# EAGLE schematic zx81c (EAGLE 7.6.0)
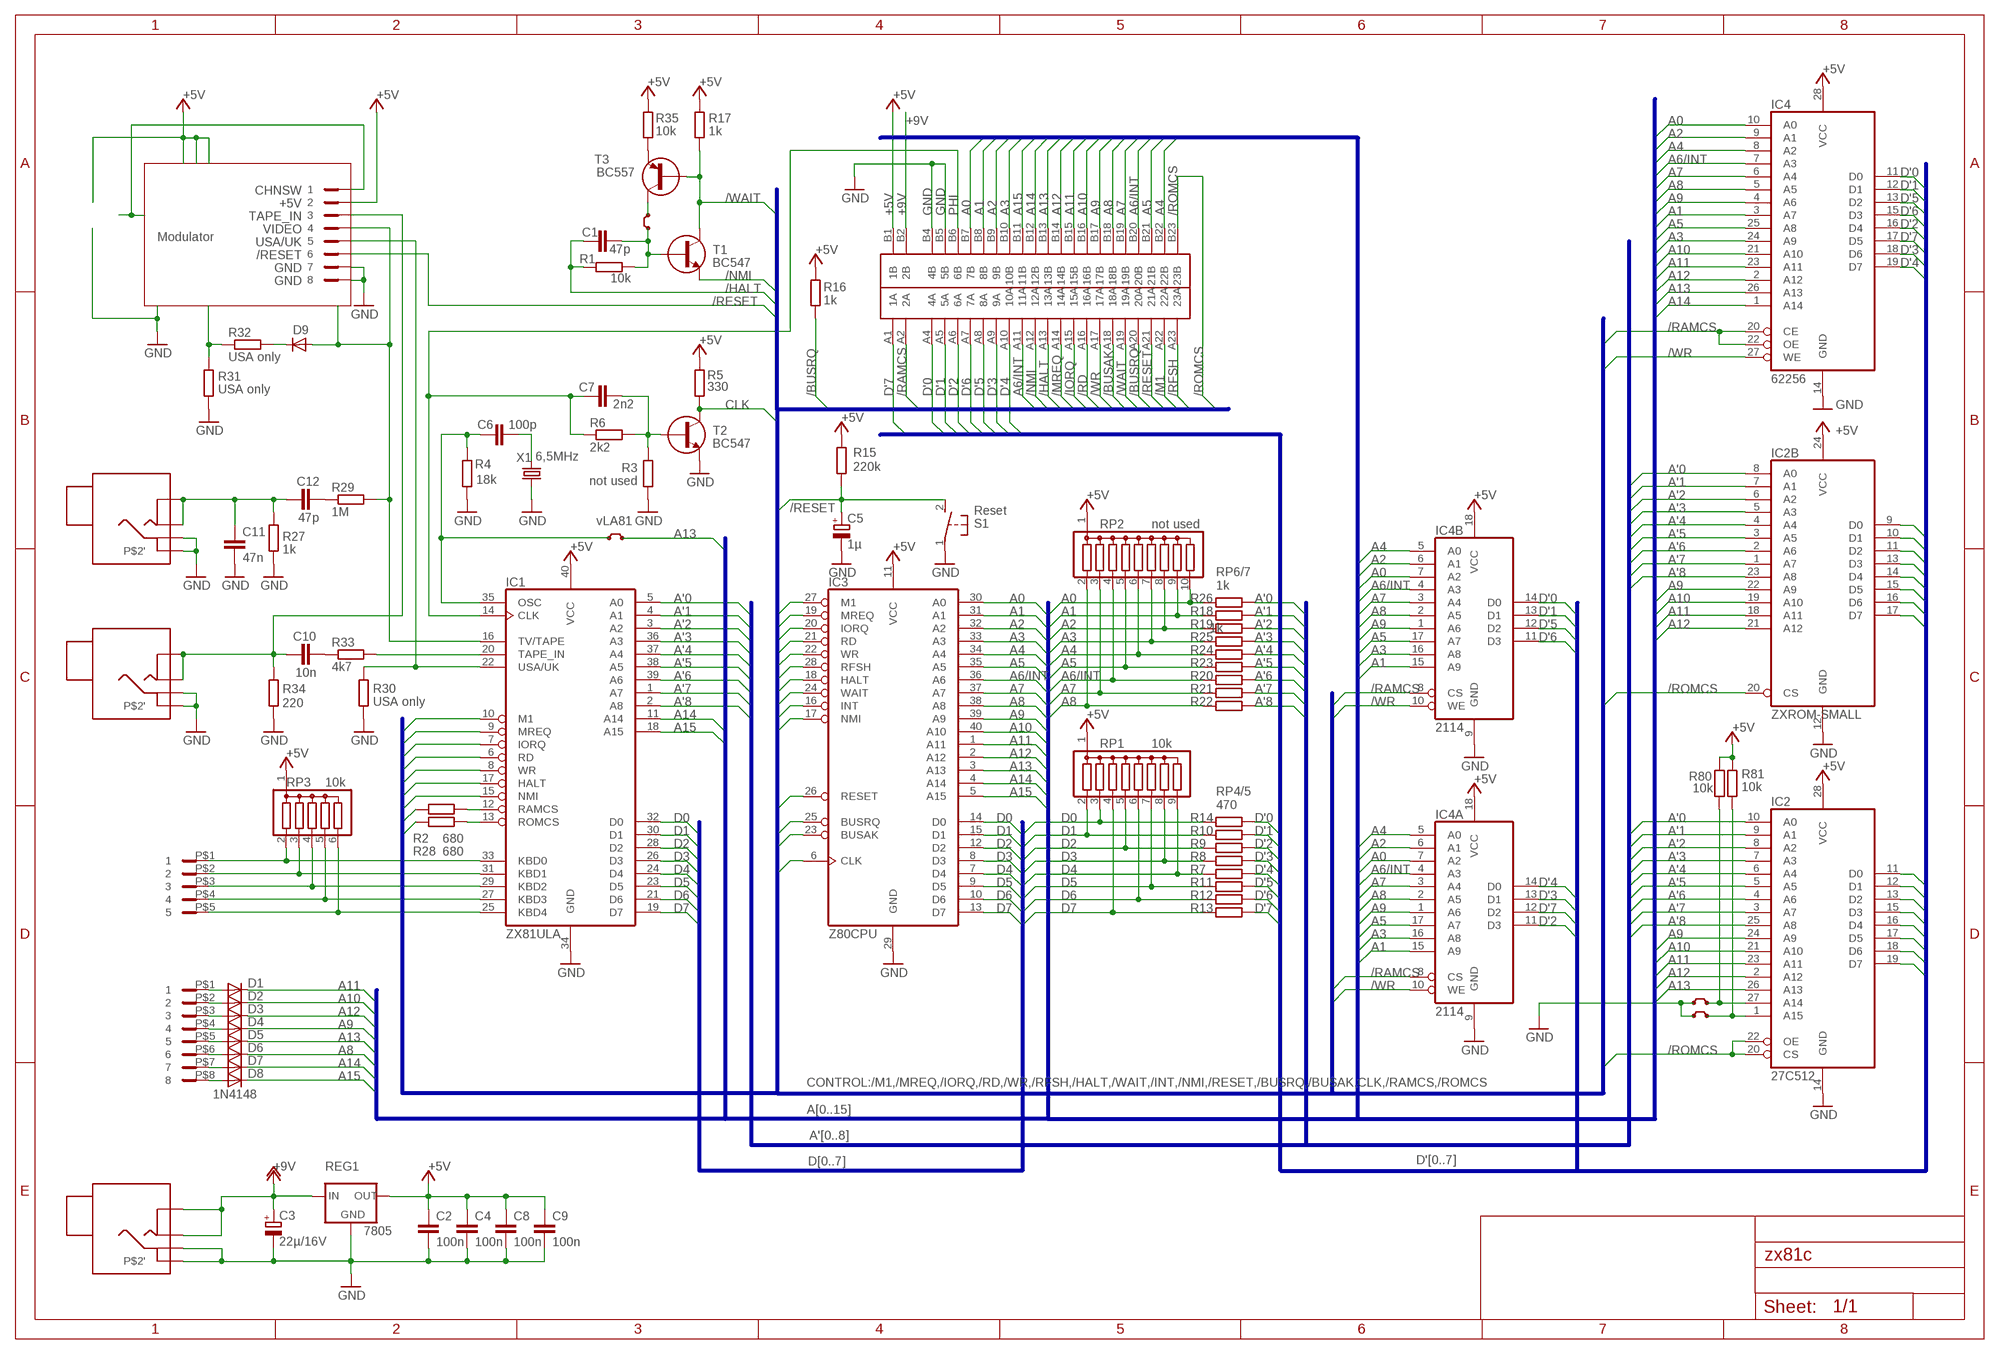
[diagram p0: schematic, sheet 1]

## Parts
C1  47p  C  [C025-025X050]
C2  100n  C  [C025-025X050]
C3  22µ/16V  CPOLE5-5  [E5-5]
C4  100n  C  [C025-025X050]
C5  1µ  CPOLE3,8-5  [E3,8-5]
C6  100p  C  [C025-025X050]
C7  2n2  C  [C025-025X050]
C8  100n  C  [C025-025X050]
C9  100n  C  [C025-025X050]
C10  10n  C  [C025-025X050]
C11  47n  C  [C025-025X050]
C12  47p  C  [C025-025X050]
D1  1N4148  DIODEDTR  [D-TR-10]
D2  1N4148  DIODEDTR  [D-TR-10]
D3  1N4148  DIODEDTR  [D-TR-10]
D4  1N4148  DIODEDTR  [D-TR-10]
D5  1N4148  DIODEDTR  [D-TR-10]
D6  1N4148  DIODEDTR  [D-TR-10]
D7  1N4148  DIODEDTR  [D-TR-10]
D8  1N4148  DIODEDTR  [D-TR-10]
D9  DIODED15  [D15]
IC1  ZX81ULA  [DIL40]
IC2  27C512  [DIL28]
IC2B  ZXROM-SMALL  [DIL24]
IC3  Z80CPU  [DIL40]
IC4  62256  [DIL28]
IC4A  2114  [DIL18]
IC4B  2114  [DIL18]
JP1  JUMPER  [JUMPER]
JP2  JUMPER  [JUMPER]
JP3  JUMPER  [JUMPER]
JP4  JUMPER  [JUMPER]
K1  ZX81CONN  [ZX81CON]
K2  MIC  ZXKLINKE4POL  [ZXKLINKE4POL]
K3  EAR  ZXKLINKE4POL  [ZXKLINKE4POL]
K4  DCIN  ZXKLINKE4POL  [ZXKLINKE4POL]
K5  PINHEAD-2X4  [PINHEAD2X4]
KB1  ZXKBD5CON  [ZXKDB5]
KB2  ZXKBD8CON  [ZXKBD8]
R1  10k  RR207/12  [R207/12]
R2  680  RR207/12  [R207/12]
R3  not used  RR207/12  [R207/12]
R4  18k  RR207/12  [R207/12]
R5  330  RR207/12  [R207/12]
R6  2k2  RR207/12  [R207/12]
R15  220k  RR207/12  [R207/12]
R16  1k  RR207/12  [R207/12]
R17  1k  RR207/12  [R207/12]
R27  1k  RR207/12  [R207/12]
R28  680  RR207/12  [R207/12]
R29  1M  RR207/12  [R207/12]
R30  USA only  RR207/12  [R207/12]
R31  USA only  RR207/12  [R207/12]
R32  USA only  RR207/12  [R207/12]
R33  4k7  RR207/12  [R207/12]
R34  220  RR207/12  [R207/12]
R35  10k  RR207/12  [R207/12]
R80  10k  RR207/12  [R207/12]
R81  10k  RR207/12  [R207/12]
REG1  7805  78XX  [78XXL]
RP1  10k  RSIL8  [SIL9]
RP2  not used  RSIL9  [SIL10]
RP3  10k  RSIL5  [SIL6]
RP4  470  RSILP4  [SIL8P]
RP5  470  RSILP4  [SIL8P]
RP6  1k  RSILP4  [SIL8P]
RP7  1k  RSILP5  [SIL10P]
S1  Reset  31-XX  [B3F-31XX]
T1  BC547  T-NPN-BC547  [TO92]
T2  BC547  T-NPN-BC547  [TO92]
T3  BC557  T-PNP-BC557  [TO92]
X1  6,5MHz  CRYSTAL  [HC49]

## Nets
+5V: C2.1 C4.1 C8.1 C9.1 IC1.40(VCC) IC2.28(VCC) IC2B.24(VCC) IC3.11(VCC) IC4.28(VCC) IC4A.18(VCC) IC4B.18(VCC) K1.B1(1B) K5.2 R5.2 R15.2 R16.1 R17.2 R35.2 R80.2 R81.2 REG1.OUT RP1.1 RP2.1 RP3.1
+9V: C3.+ K1.B2(2B) K4.1 K4.1'(P$1') REG1.IN
/BUSAK: IC3.23(BUSAK) K1.A18(18A)
/BUSRQ: IC3.25(BUSRQ) K1.A20(20A) R16.2
/HALT: C1.1 IC1.17(HALT) IC3.18(HALT) K1.A13(13A) R1.1
/IORQ: IC1.7(IORQ) IC3.20(IORQ) K1.A15(15A)
/M1: IC1.10(M1) IC3.27(M1) K1.A22(22A)
/MREQ: IC1.9(MREQ) IC3.19(MREQ) K1.A14(14A)
/NMI: IC1.15(NMI) IC3.17(NMI) K1.A12(12A) T1.E
/RAMCS: IC4.20(CE) IC4.22(OE) IC4A.8(CS) IC4B.8(CS) K1.A2(2A) R2.2
/RD: IC1.6(RD) IC3.21(RD) K1.A16(16A)
/RESET: C5.+ IC3.26(RESET) K1.A21(21A) K5.6 R15.1 S1.2(S)
/RFSH: IC3.28(RFSH) K1.A23(23A)
/ROMCS: IC2.20(CS) IC2.22(OE) IC2B.20(CS) K1.B23(23B) R28.2
/WAIT: IC3.24(WAIT) K1.A19(19A) R17.1 T1.C T3.B
/WR: IC1.8(WR) IC3.22(WR) IC4.27(WE) IC4A.10(WE) IC4B.10(WE) K1.A17(17A)
A0: IC3.30(A0) IC4.10(A0) IC4A.7(A2) IC4B.7(A2) K1.B7(7B) RP2.10 RP6.8
A1: IC3.31(A1) IC4.3(A7) IC4A.15(A9) IC4B.15(A9) K1.B8(8B) RP2.9 RP7.1
A2: IC3.32(A2) IC4.9(A1) IC4A.6(A1) IC4B.6(A1) K1.B9(9B) RP2.8 RP7.4
A3: IC3.33(A3) IC4.24(A9) IC4A.16(A8) IC4B.16(A8) K1.B10(10B) RP2.7 RP6.6
A4: IC3.34(A4) IC4.8(A2) IC4A.5(A0) IC4B.5(A0) K1.B22(22B) RP2.6 RP6.4
A5: IC3.35(A5) IC4.25(A8) IC4A.17(A7) IC4B.17(A7) K1.B21(21B) RP2.5 RP6.2
A6/INT: IC3.16(INT) IC3.36(A6) IC4.7(A3) IC4A.4(A3) IC4B.4(A3) K1.A11(11A) K1.B20(20B) RP2.4 RP7.6
A7: IC3.37(A7) IC4.6(A4) IC4A.3(A4) IC4B.3(A4) K1.B19(19B) RP2.3 RP7.8
A8: D6.C IC3.38(A8) IC4.5(A5) IC4A.2(A5) IC4B.2(A5) K1.B18(18B) RP2.2 RP7.10
A9: D4.C IC2.24(A9) IC2B.22(A9) IC3.39(A9) IC4.4(A6) IC4A.1(A6) IC4B.1(A6) K1.B17(17B)
A10: D2.C IC2.21(A10) IC2B.19(A10) IC3.40(A10) IC4.21(A10) K1.B16(16B)
A11: D1.C IC2.23(A11) IC2B.18(A11) IC3.1(A11) IC4.23(A11) K1.B15(15B)
A12: D3.C IC2.2(A12) IC2B.21(A12) IC3.2(A12) IC4.2(A12) K1.B14(14B)
A13: D5.C IC2.26(A13) IC3.3(A13) IC4.26(A13) JP3.2 K1.B13(13B)
A14: D7.C IC1.11(A14) IC3.4(A14) IC4.1(A14) K1.B12(12B)
A15: D8.C IC1.18(A15) IC3.5(A15) K1.B11(11B)
A'0: IC1.5(A0) IC2.10(A0) IC2B.8(A0) RP6.7
A'1: IC1.4(A1) IC2.9(A1) IC2B.7(A1) RP7.2
A'2: IC1.3(A2) IC2.8(A2) IC2B.6(A2) RP7.3
A'3: IC1.36(A3) IC2.7(A3) IC2B.5(A3) RP6.5
A'4: IC1.37(A4) IC2.6(A4) IC2B.4(A4) RP6.3
A'5: IC1.38(A5) IC2.5(A5) IC2B.3(A5) RP6.1
A'6: IC1.39(A6) IC2.4(A6) IC2B.2(A6) RP7.5
A'7: IC1.1(A7) IC2.3(A7) IC2B.1(A7) RP7.7
A'8: IC1.2(A8) IC2.25(A8) IC2B.23(A8) RP7.9
CHNSW: K5.1
CLK: IC3.6(CLK) R5.1 T2.C
D0: IC1.32(D0) IC3.14(D0) RP1.3 RP5.7
D1: IC1.30(D1) IC3.15(D1) RP1.2 RP4.7
D2: IC1.28(D2) IC3.12(D2) RP1.5 RP4.5
D3: IC1.26(D3) IC3.8(D3) RP1.8 RP4.3
D4: IC1.24(D4) IC3.7(D4) RP1.9 RP4.2
D5: IC1.23(D5) IC3.9(D5) RP1.7 RP5.2
D6: IC1.21(D6) IC3.10(D6) RP1.6 RP5.3
D7: IC1.19(D7) IC3.13(D7) RP1.4 RP5.6
D'0: IC2.11(D0) IC2B.9(D0) IC4.11(D0) IC4B.14(D0) K1.A4(4A) RP5.8
D'1: IC2.12(D1) IC2B.10(D1) IC4.12(D1) IC4B.13(D1) K1.A5(5A) RP4.8
D'2: IC2.13(D2) IC2B.11(D2) IC4.16(D4) IC4A.11(D3) K1.A6(6A) RP4.6
D'3: IC2.15(D3) IC2B.13(D3) IC4.18(D6) IC4A.13(D1) K1.A9(9A) RP4.4
D'4: IC2.16(D4) IC2B.14(D4) IC4.19(D7) IC4A.14(D0) K1.A10(10A) RP4.1
D'5: IC2.17(D5) IC2B.15(D5) IC4.13(D2) IC4B.12(D2) K1.A8(8A) RP5.1
D'6: IC2.18(D6) IC2B.16(D6) IC4.15(D3) IC4B.11(D3) K1.A7(7A) RP5.4
D'7: IC2.19(D7) IC2B.17(D7) IC4.17(D5) IC4A.12(D2) K1.A1(1A) RP5.5
GND: C2.2 C3.- C4.2 C5.- C8.2 C9.2 C11.2 IC1.34(GND) IC2.14(GND) IC2B.12(GND) IC3.29(GND) IC4.14(GND) IC4A.9(GND) IC4B.9(GND) JP1.1 JP2.1 K1.B4(4B) K1.B5(5B) K2.2 K2.2'(P$2') K3.2 K3.2'(P$2') K4.2 K4.2'(P$2') K5.7 K5.8 R3.1 R4.1 R27.1 R30.2 R31.1 R34.1 REG1.GND S1.1(P) T2.E X1.1
KBD0: IC1.33(KBD0) KB1.P$1 RP3.2
KBD1: IC1.31(KBD1) KB1.P$2 RP3.3
KBD2: IC1.29(KBD2) KB1.P$3 RP3.4
KBD3: IC1.27(KBD3) KB1.P$4 RP3.5
KBD4: IC1.25(KBD4) KB1.P$5 RP3.6
N$1: IC1.12(RAMCS) R2.1
N$2: IC1.13(ROMCS) R28.1
N$3: C1.2 JP4.1 R1.2 T1.B
N$4: C6.2 X1.2
N$5: C6.1 IC1.35(OSC) JP3.1 R4.2
N$6: C7.2 R3.2 R6.2 T2.B
N$7: IC2.27(A14) JP1.2 R80.1
N$8: D1.A KB2.P$1
N$9: D2.A KB2.P$2
N$10: D3.A KB2.P$3
N$11: D4.A KB2.P$4
N$12: D5.A KB2.P$5
N$13: D6.A KB2.P$6
N$14: D7.A KB2.P$7
N$15: D8.A KB2.P$8
N$17: C10.2 R33.1
N$21: C12.2 R29.1
N$22: IC2.1(A15) JP2.2 R81.1
N$23: D9.C R32.2
N$24: R35.1 T3.E
N$25: R31.2 R32.1
N$26: JP4.2 T3.C
PHI: C7.1 IC1.14(CLK) K1.B6(6B) R6.1
TAPE_IN: C10.1 K3.1 K3.1'(P$1') K5.3 R34.2
TAPE_OUT: C11.1 C12.1 K2.1 K2.1'(P$1') R27.2
TAPEIN: IC1.20(TAPE_IN) R33.2
USA/UK: IC1.22(USA/UK) K5.5 R30.1
VIDEO: D9.A IC1.16(TV/TAPE) K5.4 R29.2

## Buses
D[0..7]
D'[0..7]
A[0..15]
A'[0..8]
CONTROL:/M1,/MREQ,/IORQ,/RD,/WR,/RFSH,/HALT,/WAIT,/INT,/NMI,/RESET,/BUSRQ,/BUSAK,CLK,/RAMCS,/ROMCS

## Notes on the sheet
- Modulator
- vLA81
- RP6/7
  1k
- R26
- R18
- R19
- R25
- R24
- R23
- R20
- R21
- R22
- RP4/5
  470
- R14
- R10
- R9
- R8
- R7
- R11
- R12
- R13

## Library data of the parts
C1 C2 C4 C6-C12 = sinclair:C
C3 C5 = sinclair:CPOL
D1-D9 = sinclair:DIODE
IC1 = sinclair:ZX81ULA
IC2 = sinclair:27C512
IC2B = sinclair:ZXROM-SMALL
IC3 = sinclair:Z80CPU
IC4 = sinclair:62256
IC4A IC4B = sinclair:2114
JP1-JP4 = sinclair:JUMPER
K1 = sinclair:ZX81CONN
K2-K4 = sinclair:ZXKLINKE4POL
K5 = sinclair:PINHEAD-2X4
KB1 = sinclair:ZXKBD5CON
KB2 = sinclair:ZXKBD8CON
R1-R6 R15-R17 R27-R35 R80 R81 = sinclair:R
REG1 = sinclair:78XX
RP1 = sinclair:RSIL8
RP2 = sinclair:RSIL9
RP3 = sinclair:RSIL5
RP4-RP6 = sinclair:RSILP4
RP7 = sinclair:RSILP5
S1 = switch-omron:31-XX: OMRON SWITCH; MPN: B3F-3100; OC_FARNELL: 959704; OC_NEWARK: 36M3582
T1 T2 = sinclair:T-NPN-BC547
T3 = sinclair:T-PNP-BC557
X1 = sinclair:CRYSTAL